# EAGLE design atx_distributor_v1.0 (EAGLE 6.4)
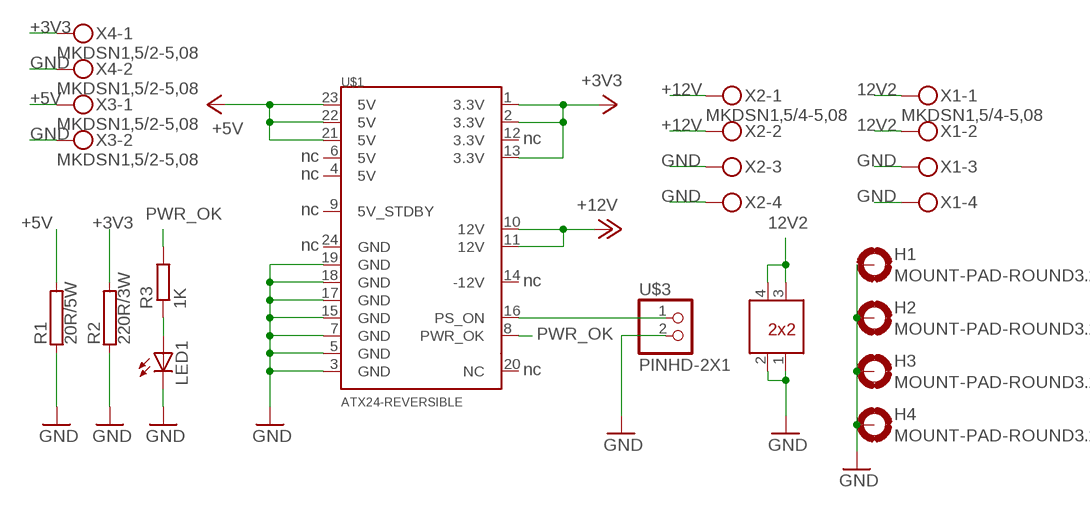
[diagram p0: schematic, sheet 1]

## Parts
H1  MOUNT-PAD-ROUND3.2  [3,2-PAD]
H2  MOUNT-PAD-ROUND3.2  [3,2-PAD]
H3  MOUNT-PAD-ROUND3.2  [3,2-PAD]
H4  MOUNT-PAD-ROUND3.2  [3,2-PAD]
LED1  LED3MM  [LED3MM]
R1  20R/5W  RHPS923  [HPS923]
R2  220R/3W  RCA4050  [CA4050]
R3  1K  R-EU_0207/10  [0207/10]
U$1  ATX24-REVERSIBLE  [ATX24]
U$2  ATX2X2  [ATX2X2]
U$3  PINHD-2X1  [PINHD-2X1]
X1  MKDSN1,5/4-5,08  [MKDSN1,5/4-5,08]
X2  MKDSN1,5/4-5,08  [MKDSN1,5/4-5,08]
X3  MKDSN1,5/2-5,08  [MKDSN1,5/2-5,08]
X4  MKDSN1,5/2-5,08  [MKDSN1,5/2-5,08]

## Nets
12V2: U$2.3 U$2.4 X1.1 X1.2
+3V3: R2.2 U$1.1(3.3V) U$1.2(3.3V) U$1.13(3.3V) X4.1
+5V: R1.2 U$1.21(5V) U$1.22(5V) U$1.23(5V) X3.1
+12V: U$1.10(12V) U$1.11(12V) X2.1 X2.2
GND: H1.B3,2(MOUNT) H2.B3,2(MOUNT) H3.B3,2(MOUNT) H4.B3,2(MOUNT) LED1.K(C) R1.1 R2.1 U$1.3(GND) U$1.5(GND) U$1.7(GND) U$1.15(GND) U$1.17(GND) U$1.18(GND) U$1.19(GND) U$2.1 U$2.2 U$3.2 X1.3 X1.4 X2.3 X2.4 X3.2 X4.2
N$1: U$1.16(PS_ON) U$3.1
N$2: LED1.A R3.1
PWR_OK: R3.2 U$1.8(PWR_OK)
Unconnected: U$1.4(5V) U$1.6(5V) U$1.9(5V_STDBY) U$1.12(3.3V) U$1.14(-12V) U$1.20(NC) U$1.24(GND)

## Notes on the sheet
- nc
- nc
- nc
- nc
- nc
- nc
- nc

## Library data of the parts
H1-H4 = holes:MOUNT-PAD-ROUND: MOUNTING PAD, round
LED1 = led:LED: LED OSRAM: - CHIPLED LG R971, LG N971, LY N971, LG Q971, LY Q971, LO R971, LY R971 LH N974, LH R974 LS Q976, LO Q976, LY Q976 LO Q996 - Hyper CHIPLED LW Q18S LB Q993, LB Q99A, LB R99A - SideLED LS A670, LO A670, LY A670, LG A670, LP A670 LB A673, LV A673, LT A673, LW A673 LH A674 LY A675 LS A676, LA A676, LO A676, LY A676, LW A676 LS A679, LY A679, LG A679 - Hyper Micro SIDELED® LS Y876, LA Y876, LO Y876, LY Y876 LT Y87S - SmartLED LW L88C, LW L88S LB L89C, LB L89S, LG L890 LS L89K, LO L89K, LY L89K LS L896, LA L896, LO L896, LY L896 - TOPLED LS T670, LO T670, LY T670, LG T670, LP T670 LSG T670, LSP T670, LSY T670, LOP T670, LYG T670 LG T671, LOG T671, LSG T671 LB T673, LV T673, LT T673, LW T673 LH T674 LS T676, LA T676, LO T676, LY T676, LB T676, LH T676, LSB T676, LW T676 LB T67C, LV T67C, LT T67C, LS T67K, LO T67K, LY T67K, LW E67C LS E67B, LA E67B, LO E67B, LY E67B, LB E67C, LV E67C, LT E67C LW T67C LS T679, LY T679, LG T679 LS T770, LO T770, LY T770, LG T770, LP T770 LB T773, LV T773, LT T773, LW T773 LH T774 LS E675, LA E675, LY E675, LS T675 LS T776, LA T776, LO T776, LY T776, LB T776 LHGB T686 LT T68C, LB T68C - Hyper Mini TOPLED® LB M676 - Mini TOPLED Santana® LG M470 LS M47K, LO M47K, LY M47K Source: http://www.osram.convergy.de LUXEON: - LUMILED® LXK2-PW12-R00, LXK2-PW12-S00, LXK2-PW14-U00, LXK2-PW14-V00 LXK2-PM12-R00, LXK2-PM12-S00, LXK2-PM14-U00 LXK2-PE12-Q00, LXK2-PE12-R00, LXK2-PE12-S00, LXK2-PE14-T00, LXK2-PE14-U00 LXK2-PB12-K00, LXK2-PB12-L00, LXK2-PB12-M00, LXK2-PB14-N00, LXK2-PB14-P00, LXK2-PB14-Q00 LXK2-PR12-L00, LXK2-PR12-M00, LXK2-PR14-Q00, LXK2-PR14-R00 LXK2-PD12-Q00, LXK2-PD12-R00, LXK2-PD12-S00 LXK2-PH12-R00, LXK2-PH12-S00 LXK2-PL12-P00, LXK2-PL12-Q00, LXK2-PL12-R00 Source: www.luxeon.com KINGBRIGHT: KA-3528ASYC Source: www.kingbright.com
R1 R2 = resistor-power:R: Power Resitor; OC_FARNELL: unknown; OC_NEWARK: unknown
R3 = resistor:R-EU_: RESISTOR, European symbol
U$1 = SparkFun:ATX24-REVERSIBLE
U$2 = SparkFun:ATX2X2
U$3 = pinhead_2p:PINHD-2X1
X1 X2 = con-phoenix-508:MKDSN1,5/4-5,08: MKDSN 1,5/ 4-5,08 Printklemme Nennstrom: 13,5 A Nennspannung: 250 V Rastermaß: 5,08 mm Polzahl: 4 Anschlussart: Schraubanschluss Montage: Löten Anschlussrichtung Leiter/Platine: 0 ° Artikelnummer: 1729144 Source: http://eshop.phoenixcontact.com .. 1729144.pdf; MPN: SMKDSN1,5/4-5,08; OC_FARNELL: 1792905; OC_NEWARK: 70R0300
X3 X4 = con-phoenix-508:MKDSN1,5/2-5,08: MKDSN 1,5/ 2-5,08 Printklemme Nennstrom: 13,5 A Nennspannung: 250 V Rastermaß: 5,08 mm Polzahl: 2 Anschlussart: Schraubanschluss Montage: Löten Anschlussrichtung Leiter/Platine: 0 ° Artikelnummer: 1729128 Source: http://eshop.phoenixcontact.com .. 1729128.pdf; MPN: MKDSN 1,5/2-5.08; OC_FARNELL: 1792903; OC_NEWARK: 30M2397

## Board
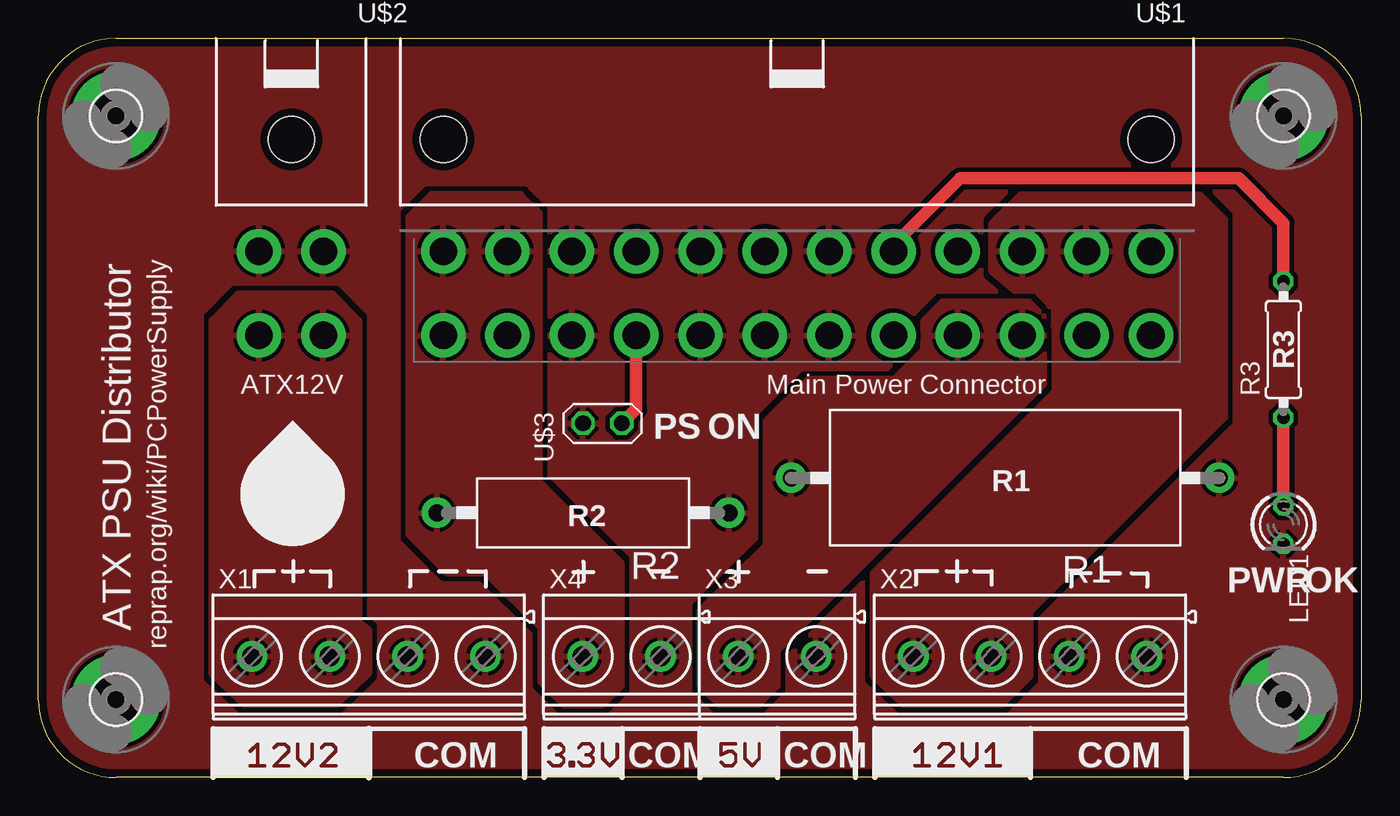
[diagram p1: board, top side]
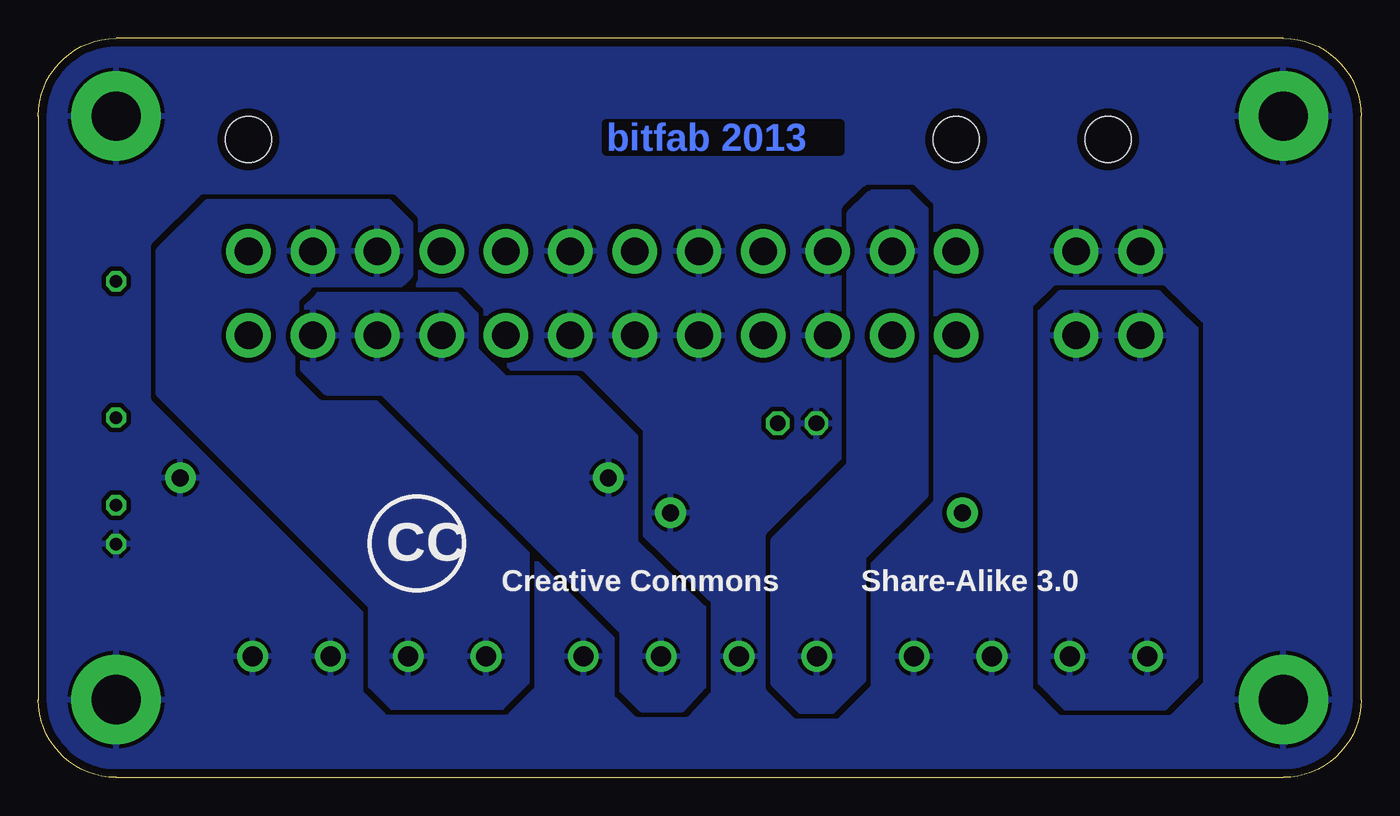
[diagram p2: board, bottom side, seen from below]

Size 86.36 x 48.26 mm. Coordinates in mm from the lower left corner, seen from the top.
Outline: 86.36,43.18 86.36,5.08 arc-90 81.28,0 5.08,0 arc-90 0,5.08 0,43.18 arc-90 5.08,48.26 81.28,48.26 arc-90 86.36,43.18
Copper layers (1*16): Top 0.035mm / dielectric 1.5mm / Bottom 0.035mm
Design rules "default *": minimum track width 10mil, minimum drill 24mil, track to track 12mil, track to pad 12mil, pad to pad 12mil, via to via 12mil, smd to smd 12mil, copper to edge 20mil, drill to drill 8mil, minimum pad ring 10mil, minimum via ring 8mil, stop-mask expansion 8mil, vias tented up to drill 0mil, thermal gap 10mil

### Footprints (pad centres in the part's own frame; a part is rotated, then mirrored left to right if it is on the bottom)
3,2-PAD = drill 3.2 pad 5.842: B3,2 0,0
LED3MM = drill 0.813 octagon: A -1.27,0; K 1.27,0
HPS923 = drill 1.1 pad 2: 1 -13.97,0; 2 13.97,0
CA4050 = drill 1.1 pad 2: 1 -9.525,0; 2 9.525,0
0207/10 = drill 0.813 octagon: 1 -4.445,0; 2 4.445,0
ATX24 = drill 1.8 pad 2.9: 1 23.1,6.03; 2 18.9,6.03; 3 14.7,6.03; 4 10.5,6.03; 5 6.3,6.03; 6 2.1,6.03; 7 -2.1,6.03; 8 -6.3,6.03; 9 -10.5,6.03; 10 -14.7,6.03; 11 -18.9,6.03; 12 -23.1,6.03; 13 23.1,11.53; 14 18.9,11.53; 15 14.7,11.53; 16 10.5,11.53; 17 6.3,11.53; 18 2.1,11.53; 19 -2.1,11.53; 20 -6.3,11.53; 21 -10.5,11.53; 22 -14.7,11.53; 23 -18.9,11.53; 24 -23.1,11.53 | hole 3: -23.1,-1.27; 23.1,-1.27
ATX2X2 = drill 1.8 pad 2.9: 1 2.1,6.03; 2 -2.1,6.03; 3 2.1,11.53; 4 -2.1,11.53 | hole 3: 0,-1.27
PINHD-2X1 = drill 1.016 octagon: 1 0,-1.27; 2 0,1.27
MKDSN1,5/4-5,08 = drill 1.3 pad 2: 1 -7.641,0.025; 2 -2.561,0.025; 3 2.519,0.025; 4 7.599,0.025
MKDSN1,5/2-5,08 = drill 1.3 pad 2: 1 -2.561,0.025; 2 2.519,0.025

### Placement (x,y rotation side)
H1  81.28,43.18 180 top
H2  5.08,5.08 180 top
H3  81.28,5.08 180 top
H4  5.08,43.18 180 top
LED1  81.28,16.51 270 top
R1  63.12,19.56 180 top
R2  35.56,17.27 180 top
R3  81.28,27.94 90 top
U$1  49.53,40.39 180 top
U$2  16.51,40.39 180 top
U$3  36.83,23.11 90 top
X1  21.59,7.87 0 top
X2  64.77,7.87 0 top
X3  48.26,7.87 0 top
X4  38.1,7.87 0 top

### Tracks (layer width: path | path; a pad name or v marks a point on that pad's centre or on a via)
12V2
  pour Top: 11.3,6.73 11.3,29.84 13.08,31.62 19.18,31.62 20.95,29.84 20.95,10.16 21.59,9.65 21.59,6.78 19.43,4.7 13.46,4.7
  pour Bottom (rank 2): 13.21,31.62 19.68,31.62 20.95,30.38 20.95,6.22 19.3,4.57 12.83,4.57 10.79,6.6 10.79,29.26
+3V3
  pour Top: 31.5,38.1 25.65,38.1 24.13,36.58 24.13,15.88 26.67,13.34 29.21,13.34 32.77,9.78 32.77,6.22 34.29,4.7 36.83,4.7 38.1,5.97 38.1,13.97 32.77,19.3 32.77,36.83
  pour Bottom: 31.88,38.23 29.59,38.23 28.45,37.08 28.45,18.41 32.51,14.35 32.51,6.35 34.54,4.32 36.58,4.32 38.35,6.1 38.35,15.49 33.4,20.45 33.4,36.83 32.13,38.1
+5V
  pour Top: 43.18,5.97 43.18,10.92 47.5,15.16 47.5,23.29 50.29,26.04 55.88,26.04 57.78,27.94 57.78,29.84 59.05,31.11 64.64,31.11 65.66,30.1 65.66,25.65 48.26,8.26 48.26,5.97 46.99,4.7 44.45,4.7
  pour Bottom: 57.78,27.91 57.78,30.2 59.05,31.5 68.07,31.5 69.09,30.48 69.09,26.67 67.56,25.15 63.88,25.15 48.26,9.53 48.26,5.71 46.99,4.45 44.32,4.45 42.93,5.97 42.93,11.05 47.37,15.37 47.37,22.23 51.18,26.04 55.88,26.04
+12V
  pour Top (isolate 0.305, rank 2): 62.23,33.02 62.23,36.2 64.14,38.1 75.82,38.1 77.47,36.45 77.47,23.5 64.77,10.79 64.77,6.6 62.87,4.7 56.52,4.7 54.48,6.6 54.48,13.84 66.29,25.65 66.29,30.48 65.15,31.62 63.88,31.62
  pour Bottom (rank 3): 63.5,37.59 62.1,36.2 62.1,32.77 63.12,31.75 68.45,31.75 69.47,30.86 69.47,26.42 67.82,24.89 64.52,24.89 54.48,14.86 54.48,6.22 56.13,4.57 63.25,4.57 64.64,5.97 64.64,11.18 78.49,25.02 78.49,34.42 75.31,37.59
GND
  pour Top (isolate 0.254, rank 3): -0.64,49.53 87.63,49.53 87.63,-1.27 -1.27,-1.27 -1.27,49.53
  pour Bottom (isolate 0.254, rank 4): 87.25,49.15 87.25,-1.4 -1.14,-1.4 -1.14,49.15
N$1
  Top 0.813: U$3.1 39.03,24.04 U$1.16
N$2
  Top 0.254: R3.1 81.28,23.37
  Top 0.813: 81.28,23.37 LED1.A
PWR_OK
  Top 0.813: U$1.8 55.83,34.75 60.2,39.12 78.36,39.12 81.28,36.2 R3.2

### Text on the board
Bottom: bitfab 2013
tPlace: R3 | ATX12V | Main Power Connector | PS | ON | R1 | R2 | PWR | OK | ATX PSU Distributor | reprap.org/wiki/PCPowerSupply | COM | COM | COM | COM
bPlace: Share-Alike 3.0 | Creative Commons | CC
bRestrict: bitfab 2013
tDocu: 12V2 | 3 | . | 3V | 5V | 12V1